# Altium schematic sheet PA.SchDoc
size A4
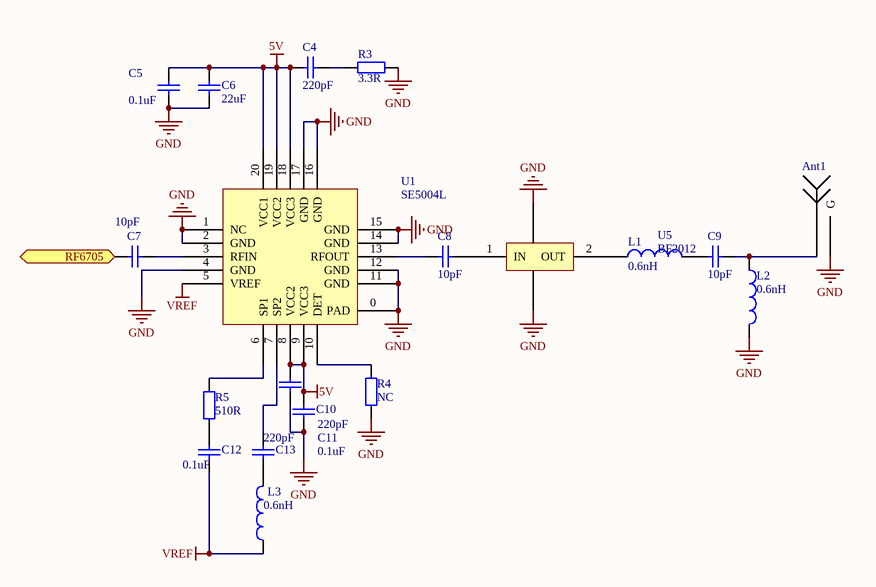
[diagram p0: PA.SchDoc]

## Parts
Ant1  Antenna  [SMA]  (value not drawn)
C4  value 220pF  [0402]  (hidden comment: Cap)
C5  value 0.1uF  [0402]  (hidden comment: Cap)
C6  value 22uF  [0402]  (hidden comment: Cap)
C7  value 10pF  [0402]  (hidden comment: Cap)
C8  value 10pF  [0402]  (hidden comment: Cap)
C9  value 10pF  [0402]  (hidden comment: Cap)
C10  value 0.1uF  [0402]  (hidden comment: Cap)
C11  value 220pF  [0402]  (hidden comment: Cap)
C12  value 0.1uF  [0402]  (hidden comment: Cap)
C13  value 220pF  [0402]  (hidden comment: Cap)
L1  value 0.6nH  [0402]  (hidden comment: Inductor)
L2  value 0.6nH  [0402]  (hidden comment: Inductor)
L3  value 0.6nH  [0402]  (hidden comment: Inductor)
R3  value 3.3R  [0402]  (hidden comment: Res2)
R4  value NC  [0402]  (hidden comment: Res2)
R5  value 510R  [0402]  (hidden comment: Res2)
U1  SE5004L  [SE5004L]
U5  BF2012  [BF2012]

## Ports
RF6705

## Nets
5V: C4.2 C5.2 C6.2 C10.2 C11.2 U1.8(VCC2) U1.9(VCC3) U1.18(VCC3) U1.19(VCC2) U1.20(VCC1)
GND: Ant1.GND(G) C5.1 C6.1 C10.1 C11.1 L2.2 R3.1 R4.1 U1.0(PAD) U1.1(NC) U1.2(GND) U1.4(GND) U1.11(GND) U1.12(GND) U1.14(GND) U1.15(GND) U1.16(GND) U1.17(GND) U5.0(OUT) U5.1(OUT)
VREF: C12.1 L3.1 U1.5(VREF)
RF6705: C7.1 ; port RF6705
NetAnt1_1: Ant1.1 C9.2 L2.1
NetC4_1: C4.1 R3.2
NetC7_2: C7.2 U1.3(RFIN)
NetC8_1: C8.1 U1.13(RFOUT)
NetC8_2: C8.2 U5.1(IN)
NetC9_1: C9.1 L1.2
NetC12_2: C12.2 R5.1
NetC13_1: C13.1 L3.2
NetC13_2: C13.2 U1.7(SP2)
NetL1_1: L1.1 U5.2(OUT)
NetR4_2: R4.2 U1.10(DET)
NetR5_2: R5.2 U1.6(SP1)

## Library data of the parts
C4-C13 = Cap: Capacitor; Published: 8-Jun-2000; LatestRevisionDate: 17-Jul-2002; LatestRevisionNote: Re-released for DXP Platform.; PackageReference: RAD-0.3; Publisher: Altium Limited; PackageDescription: Radial Cap, Thru-Hole; 2 Leads; 0.3 in Pin Spacing
L1-L3 = Inductor: Code_IEC: 1005; Published: 8-Jun-2000; LatestRevisionDate: 29-May-2009; LatestRevisionNote: IPC-7351 Footprint Added.; PackageReference: 0402-A; Publisher: Altium Limited; PackageDescription: Chip Inductor; Code_JEITA: 0402
R3-R5 = Res2: Resistor; Published: 8-Jun-2000; LatestRevisionDate: 17-Jul-2002; LatestRevisionNote: Re-released for DXP Platform.; PackageReference: AXIAL-0.4; Publisher: Altium Limited; PackageDescription: Axial Device, Thru-Hole; 2 Leads; 0.4 in Pin Spacing